# EAGLE design BBBDuino_revA (EAGLE 6.4)
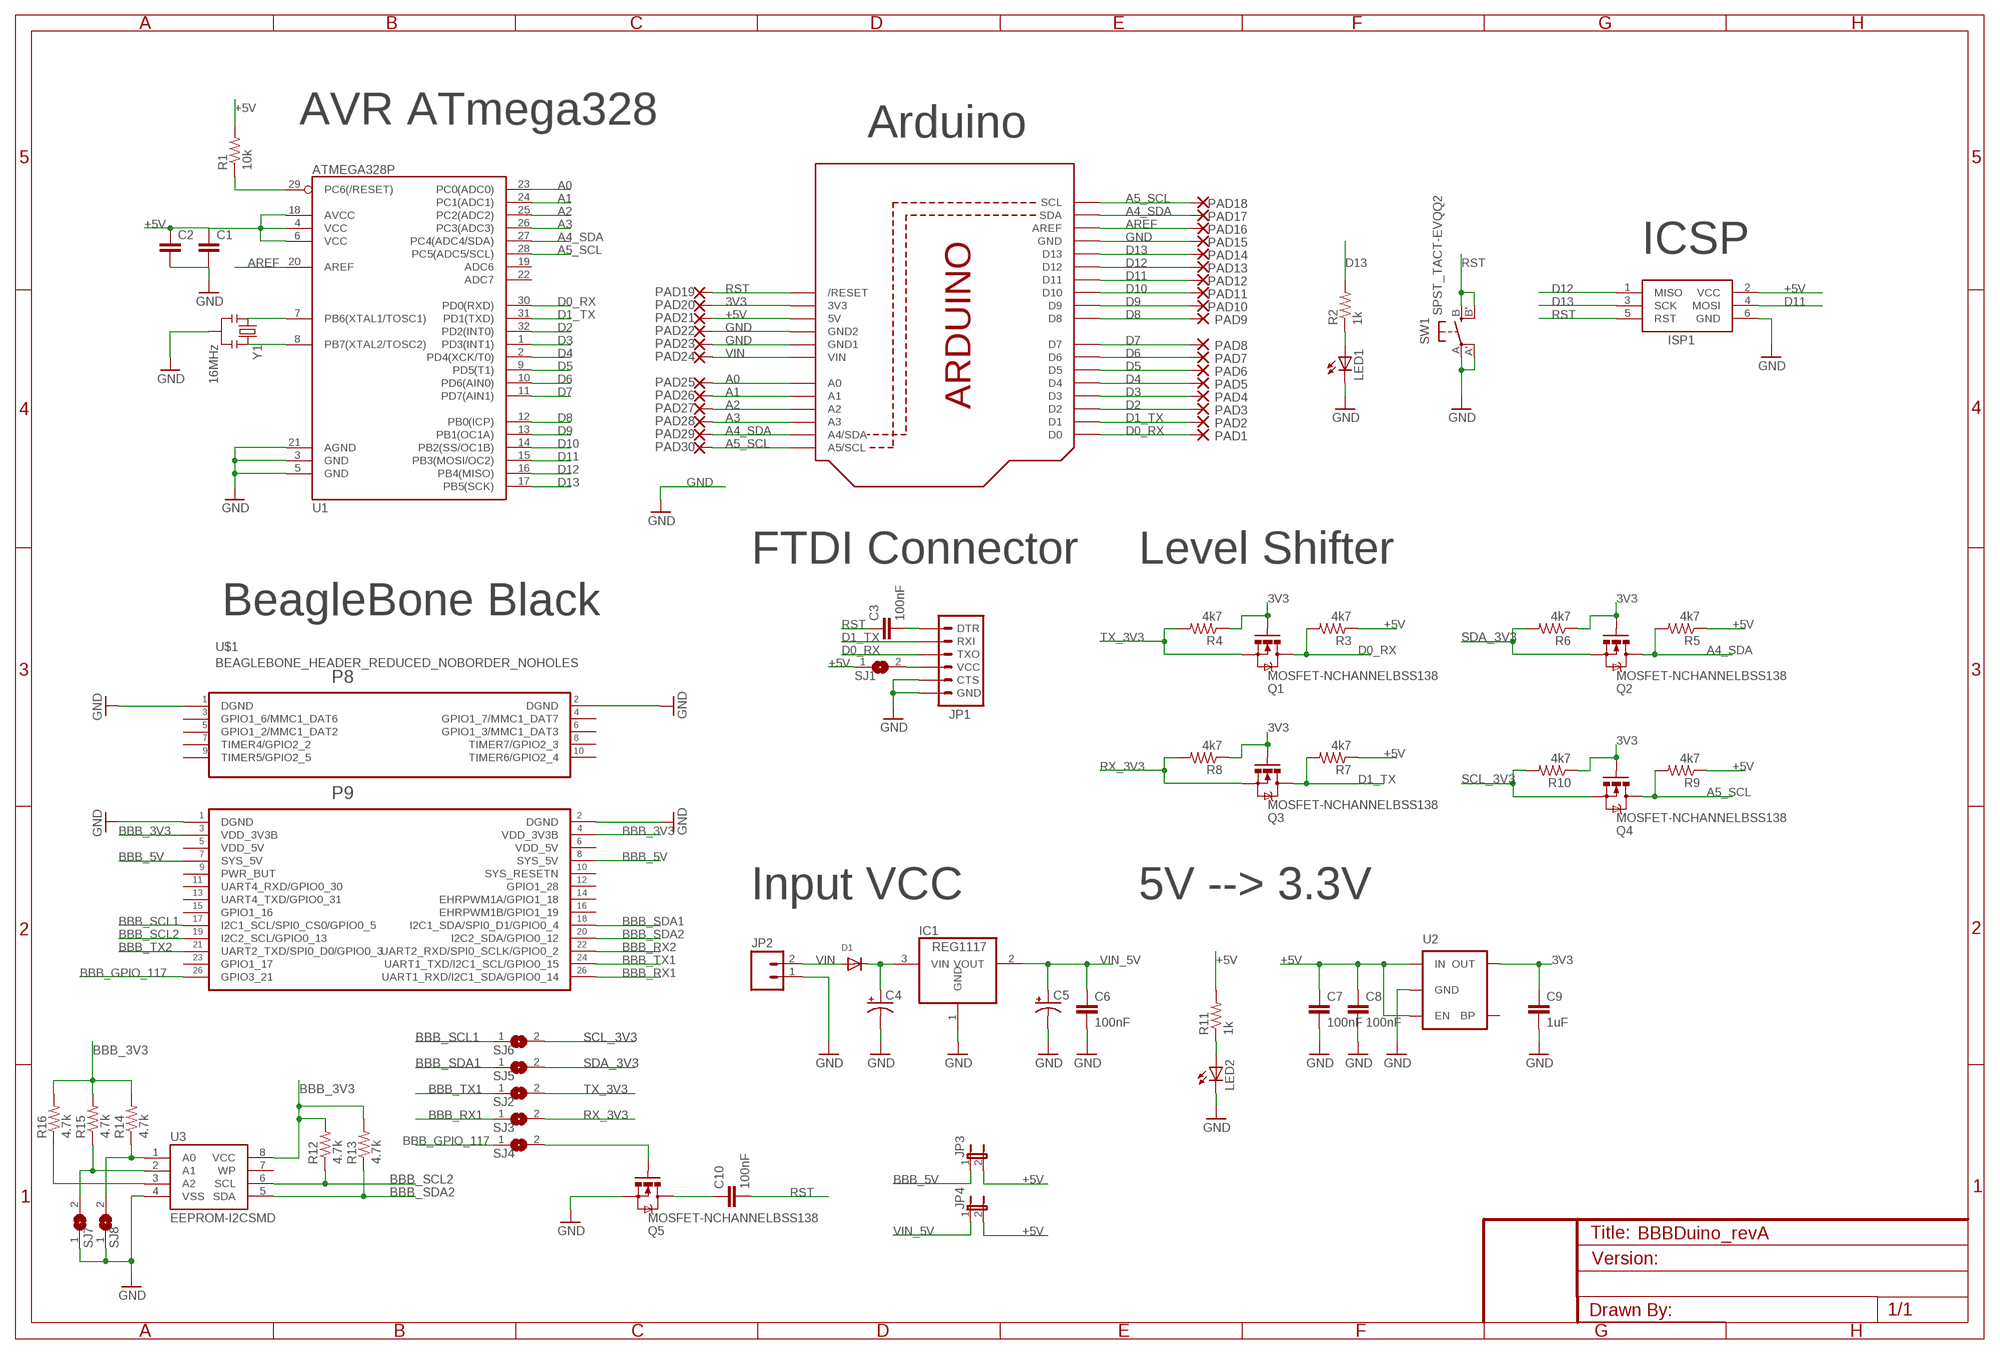
[diagram p0: schematic, sheet 1]

## Parts
C1  CAP0603-CAP  [0603-CAP]
C2  CAP0603-CAP  [0603-CAP]
C3  100nF  CAP0603-CAP  [0603-CAP]
C4  CAP_POLD  [PANASONIC_D]
C5  CAP_POLD  [PANASONIC_D]
C6  100nF  CAP0603-CAP  [0603-CAP]
C7  100nF  CAP0603-CAP  [0603-CAP]
C8  100nF  CAP0603-CAP  [0603-CAP]
C9  1uF  CAP0603-CAP  [0603-CAP]
C10  100nF  CAP0603-CAP  [0603-CAP]
D1  DIODESMA  [SMADIODE]
IC1  REG1117  [SOT223]
ISP1  AVRISP-6  [AVRISP]
JP1  ARDUINO_SERIAL_PROGRAMPTH  [1X06]
JP2  M02PTH  [1X02]
JP3  JUMPER-2PTH  [1X02]
JP4  JUMPER-2PTH  [1X02]
LED1  LEDCHIP-LED0603  [CHIP-LED0603]
LED2  LEDCHIP-LED0603  [CHIP-LED0603]
PAD1  1,6/0,9  [1,6/0,9]
PAD2  1,6/0,9  [1,6/0,9]
PAD3  1,6/0,9  [1,6/0,9]
PAD4  1,6/0,9  [1,6/0,9]
PAD5  1,6/0,9  [1,6/0,9]
PAD6  1,6/0,9  [1,6/0,9]
PAD7  1,6/0,9  [1,6/0,9]
PAD8  1,6/0,9  [1,6/0,9]
PAD9  1,6/0,9  [1,6/0,9]
PAD10  1,6/0,9  [1,6/0,9]
PAD11  1,6/0,9  [1,6/0,9]
PAD12  1,6/0,9  [1,6/0,9]
PAD13  1,6/0,9  [1,6/0,9]
PAD14  1,6/0,9  [1,6/0,9]
PAD15  1,6/0,9  [1,6/0,9]
PAD16  1,6/0,9  [1,6/0,9]
PAD17  1,6/0,9  [1,6/0,9]
PAD18  1,6/0,9  [1,6/0,9]
PAD19  1,6/0,9  [1,6/0,9]
PAD20  1,6/0,9  [1,6/0,9]
PAD21  1,6/0,9  [1,6/0,9]
PAD22  1,6/0,9  [1,6/0,9]
PAD23  1,6/0,9  [1,6/0,9]
PAD24  1,6/0,9  [1,6/0,9]
PAD25  1,6/0,9  [1,6/0,9]
PAD26  1,6/0,9  [1,6/0,9]
PAD27  1,6/0,9  [1,6/0,9]
PAD28  1,6/0,9  [1,6/0,9]
PAD29  1,6/0,9  [1,6/0,9]
PAD30  1,6/0,9  [1,6/0,9]
Q1  MOSFET-NCHANNELBSS138  [SOT23]
Q2  MOSFET-NCHANNELBSS138  [SOT23]
Q3  MOSFET-NCHANNELBSS138  [SOT23]
Q4  MOSFET-NCHANNELBSS138  [SOT23]
Q5  MOSFET-NCHANNELBSS138  [SOT23]
R1  10k  RESISTOR0603-RES  [0603-RES]
R2  1k  RESISTOR0603-RES  [0603-RES]
R3  4k7  RESISTOR0603-RES  [0603-RES]
R4  4k7  RESISTOR0603-RES  [0603-RES]
R5  4k7  RESISTOR0603-RES  [0603-RES]
R6  4k7  RESISTOR0603-RES  [0603-RES]
R7  4k7  RESISTOR0603-RES  [0603-RES]
R8  4k7  RESISTOR0603-RES  [0603-RES]
R9  4k7  RESISTOR0603-RES  [0603-RES]
R10  4k7  RESISTOR0603-RES  [0603-RES]
R11  1k  RESISTOR0603-RES  [0603-RES]
R12  4.7k  RESISTOR0603-RES  [0603-RES]
R13  4.7k  RESISTOR0603-RES  [0603-RES]
R14  4.7k  RESISTOR0603-RES  [0603-RES]
R15  4.7k  RESISTOR0603-RES  [0603-RES]
R16  4.7k  RESISTOR0603-RES  [0603-RES]
SJ1  SJ  [SJ]
SJ2  SJ  [SJ]
SJ3  SJ  [SJ]
SJ4  SJ  [SJ]
SJ5  SJ  [SJ]
SJ6  SJ  [SJ]
SJ7  SJ  [SJ]
SJ8  SJ  [SJ]
SW1  SPST_TACT-EVQQ2  [EVQ-Q2]
U1  ATMEGA328P  ATMEGA328_SMT  [TQFP32-08]
U2  MIC52053.3V  [SOT23-5]
U3  EEPROM-I2CSMD  [SO08]
U$1  BEAGLEBONE_HEADER_REDUCED_NOBORDER_NOHOLES  [BEAGLEBONE_HEADER_REDUCED_NOBORDER_NOHOLES]
U$2  ARDUINO_NOIOREF_NOBORDER_HOLES_NAMES  [ARDUINO_NOIOREF_BORDER_HOLES_NAMES]
Y1  16MHz  RESONATOR16MHZ  [RESONATOR-SMD]

## Nets
3V3: C9.1 PAD20.1(P) Q1.1(G) Q2.1(G) Q3.1(G) Q4.1(G) R4.1 R6.1 R8.1 R10.1 U2.5(OUT) U$2.3V(3V3)
+5V: C1.1 C2.1 C7.1 C8.1 ISP1.2(VCC) JP3.2 JP4.2 PAD21.1(P) R1.2 R3.1 R5.1 R7.1 R9.1 R11.2 SJ1.1 U1.4(VCC) U1.6(VCC) U1.18(AVCC) U2.1(IN) U2.3(EN) U$2.5V
A0: PAD25.1(P) U1.23(PC0(ADC0)) U$2.A0
A1: PAD26.1(P) U1.24(PC1(ADC1)) U$2.A1
A2: PAD27.1(P) U1.25(PC2(ADC2)) U$2.A2
A3: PAD28.1(P) U1.26(PC3(ADC3)) U$2.A3
A4_SDA: PAD17.1(P) PAD29.1(P) Q2.3(D) R5.2 U1.27(PC4(ADC4/SDA)) U$2.A4(A4/SDA) U$2.SDA
A5_SCL: PAD18.1(P) PAD30.1(P) Q4.3(D) R9.2 U1.28(PC5(ADC5/SCL)) U$2.A5(A5/SCL) U$2.SCL
AREF: PAD16.1(P) U1.20(AREF) U$2.AREF
BBB_3V3: R12.2 R13.2 R14.2 R15.2 R16.2 U3.8(VCC) U$1.P9_3(VDD_3V3B) U$1.P9_4(VDD_3V3B)
BBB_5V: JP3.1 U$1.P9_7(SYS_5V) U$1.P9_8(SYS_5V)
BBB_GPIO_117: SJ4.1 U$1.P9_25(GPIO3_21)
BBB_RX1: SJ3.1 U$1.P9_26(UART1_RXD/I2C1_SDA/GPIO0_14)
BBB_RX2: U$1.P9_22(UART2_RXD/SPI0_SCLK/GPIO0_2)
BBB_SCL1: SJ6.1 U$1.P9_17(I2C1_SCL/SPI0_CS0/GPIO0_5)
BBB_SCL2: R12.1 U3.6(SCL) U$1.P9_19(I2C2_SCL/GPIO0_13)
BBB_SDA1: SJ5.1 U$1.P9_18(I2C1_SDA/SPI0_D1/GPIO0_4)
BBB_SDA2: R13.1 U3.5(SDA) U$1.P9_20(I2C2_SDA/GPIO0_12)
BBB_TX1: SJ2.1 U$1.P9_24(UART1_TXD/I2C1_SCL/GPIO0_15)
BBB_TX2: U$1.P9_21(UART2_TXD/SPI0_D0/GPIO0_3)
D0_RX: JP1.3(TXO) PAD1.1(P) Q1.3(D) R3.2 U1.30(PD0(RXD)) U$2.D0
D1_TX: JP1.2(RXI) PAD2.1(P) Q3.3(D) R7.2 U1.31(PD1(TXD)) U$2.D1
D2: PAD3.1(P) U1.32(PD2(INT0)) U$2.D2
D3: PAD4.1(P) U1.1(PD3(INT1)) U$2.D3
D4: PAD5.1(P) U1.2(PD4(XCK/T0)) U$2.D4
D5: PAD6.1(P) U1.9(PD5(T1)) U$2.D5
D6: PAD7.1(P) U1.10(PD6(AIN0)) U$2.D6
D7: PAD8.1(P) U1.11(PD7(AIN1)) U$2.D7
D8: PAD9.1(P) U1.12(PB0(ICP)) U$2.D8
D9: PAD10.1(P) U1.13(PB1(OC1A)) U$2.D9
D10: PAD11.1(P) U1.14(PB2(SS/OC1B)) U$2.D10
D11: ISP1.4(MOSI) PAD12.1(P) U1.15(PB3(MOSI/OC2)) U$2.D11
D12: ISP1.1(MISO) PAD13.1(P) U1.16(PB4(MISO)) U$2.D12
D13: ISP1.3(SCK) PAD14.1(P) R2.2 U1.17(PB5(SCK)) U$2.D13
GND: C1.2 C2.2 C4.- C5.- C6.2 C7.2 C8.2 C9.2 IC1.1(GND) ISP1.6(GND) JP1.5(CTS) JP1.6(GND) JP2.1 LED1.C LED2.C PAD15.1(P) PAD22.1(P) PAD23.1(P) Q5.2(S) SJ7.1 SJ8.1 SW1.A'(P1) SW1.A(P) U1.3(GND) U1.5(GND) U1.21(AGND) U2.2(GND) U3.4(VSS) U$1.P8_1(DGND) U$1.P8_2(DGND) U$1.P9_1(DGND) U$1.P9_2(DGND) U$2.GND U$2.GND1 U$2.GND2 Y1.2
N$1: U1.7(PB6(XTAL1/TOSC1)) Y1.1
N$2: R1.1 U1.29(PC6(/RESET))
N$3: C3.2 JP1.1(DTR)
N$4: U1.8(PB7(XTAL2/TOSC2)) Y1.3
N$5: LED1.A R2.1
N$6: LED2.A R11.1
N$7: C4.+ D1.C IC1.3(VIN)
N$8: JP1.4(VCC) SJ1.2
N$9: C10.1 Q5.3(D)
N$14: Q5.1(G) SJ4.2
N$23: R14.1 SJ8.2 U3.1(A0)
N$24: R15.1 SJ7.2 U3.2(A1)
N$25: R16.1 U3.3(A2)
RST: C3.1 C10.2 ISP1.5(RST) PAD19.1(P) SW1.B'(S1) SW1.B(S) U$2.RESET(/RESET)
RX_3V3: Q3.2(S) R8.2 SJ3.2
SCL_3V3: Q4.2(S) R10.2 SJ6.2
SDA_3V3: Q2.2(S) R6.2 SJ5.2
TX_3V3: Q1.2(S) R4.2 SJ2.2
VIN: D1.A JP2.2 PAD24.1(P) U$2.VIN
VIN_5V: C5.+ C6.1 IC1.2(VOUT) JP4.1
Unconnected: U1.19(ADC6) U1.22(ADC7) U2.4(BP) U3.7(WP) U$1.P8_3(GPIO1_6/MMC1_DAT6) U$1.P8_4(GPIO1_7/MMC1_DAT7) U$1.P8_5(GPIO1_2/MMC1_DAT2) U$1.P8_6(GPIO1_3/MMC1_DAT3) U$1.P8_7(TIMER4/GPIO2_2) U$1.P8_8(TIMER7/GPIO2_3) U$1.P8_9(TIMER5/GPIO2_5) U$1.P8_10(TIMER6/GPIO2_4) U$1.P9_9(PWR_BUT) U$1.P9_10(SYS_RESETN) U$1.P9_11(UART4_RXD/GPIO0_30) U$1.P9_12(GPIO1_28) U$1.P9_13(UART4_TXD/GPIO0_31) U$1.P9_14(EHRPWM1A/GPIO1_18) U$1.P9_15(GPIO1_16) U$1.P9_16(EHRPWM1B/GPIO1_19) U$1.P9_23(GPIO1_17)

## Notes on the sheet
- AVR ATmega328 | Arduino
- ICSP
- FTDI Connector | Level Shifter
- BeagleBone Black
- Input VCC | 5V --> 3.3V

## Power pins joined to a net without a drawn wire
VDD_5V: U$1.P9_5(VDD_5V) U$1.P9_6(VDD_5V)

## Library data of the parts
C1-C3 C6-C10 = SparkFun-Capacitors:CAP: Capacitor Standard 0603 ceramic capacitor, and 0.1" leaded capacitor.
C4 C5 = SparkFun-Capacitors:CAP_POL: Capacitor Polarized These are standard SMD and PTH capacitors. Normally 10uF, 47uF, and 100uF in electrolytic and tantalum varieties. Always verify the external diameter of the through hole cap, it varies with capacity, voltage, and manufacturer. The EIA devices should be standard.
D1 = adafruit:DIODE: Diode SMADIODE - SMA Surface Mount Package 20V 1A Schottky Diode Digikey: 641-1014-6-ND DO-1N4148 - Through Hole Small Current Diode SOD-123 20V 1 A (.5mV Vf) Schottky Diode - Digikey: MBRX120TPMSCT-ND SOD-323 10V 570mA (.38mV Vf, 3ns) Schottky Diode - Digikey: ZLLS410CT-ND SOD-523 30V 30mA Schottky Diode (RB751S-40TE61) - Digikey: RB751S-40TE61CT-ND SOT23-R/W - SOT23 Package (R = Solder Paste/Reflow Ovens, W = Hand-Soldering) BAT54Film 40V 300mA - Digikey: 497-7162-1-ND
IC1 = burr-brown:REG1117: 800mA and 1A Low Dropout (LDO) Positive Regulator 1.8V, 2.5V, 2.85V, 3.3V, 5V, and Adj; MPN: REG1117; OC_FARNELL: 1097566; OC_NEWARK: 14P6981
ISP1 = adafruit:AVRISP: AVR ISP HEADER Standard 6 pin header for AVR programming
JP1 = SparkFun-Connectors:ARDUINO_SERIAL_PROGRAM: FTDI connector footprints
JP2 = SparkFun-Connectors:M02: Header 2 Standard 2-pin 0.1" header. Use with straight break away headers (SKU : PRT-00116), right angle break away headers (PRT-00553), swiss pins (PRT-00743), machine pins (PRT-00117), and female headers (PRT-00115). Molex polarized connector foot print use with SKU : PRT-08233 with associated crimp pins and housings.
JP3 JP4 = SparkFun-Passives:JUMPER-2: Jumper Basic 0.1" spaced jumper. Use with breakaway headers.
LED1 LED2 = adafruit:LED: LED OSRAM: - CHIPLED LG R971, LG N971, LY N971, LG Q971, LY Q971, LO R971, LY R971 LH N974, LH R974 LS Q976, LO Q976, LY Q976 LO Q996 - Hyper CHIPLED LW Q18S LB Q993, LB Q99A, LB R99A - SideLED LS A670, LO A670, LY A670, LG A670, LP A670 LB A673, LV A673, LT A673, LW A673 LH A674 LY A675 LS A676, LA A676, LO A676, LY A676, LW A676 LS A679, LY A679, LG A679 - Hyper Micro SIDELED® LS Y876, LA Y876, LO Y876, LY Y876 LT Y87S - SmartLED LW L88C, LW L88S LB L89C, LB L89S, LG L890 LS L89K, LO L89K, LY L89K LS L896, LA L896, LO L896, LY L896 - TOPLED LS T670, LO T670, LY T670, LG T670, LP T670 LSG T670, LSP T670, LSY T670, LOP T670, LYG T670 LG T671, LOG T671, LSG T671 LB T673, LV T673, LT T673, LW T673 LH T674 LS T676, LA T676, LO T676, LY T676, LB T676, LH T676, LSB T676, LW T676 LB T67C, LV T67C, LT T67C, LS T67K, LO T67K, LY T67K, LW E67C LS E67B, LA E67B, LO E67B, LY E67B, LB E67C, LV E67C, LT E67C LW T67C LS T679, LY T679, LG T679 LS T770, LO T770, LY T770, LG T770, LP T770 LB T773, LV T773, LT T773, LW T773 LH T774 LS E675, LA E675, LY E675, LS T675 LS T776, LA T776, LO T776, LY T776, LB T776 LHGB T686 LT T68C, LB T68C - Hyper Mini TOPLED® LB M676 - Mini TOPLED Santana® LG M470 LS M47K, LO M47K, LY M47K Source: http://www.osram.convergy.de/
PAD1-PAD30 = wirepad:1,6/0,9: THROUGH-HOLE PAD
Q1-Q5 = SparkFun-DiscreteSemi:MOSFET-NCHANNEL: Common NMOSFET Parts MFG P/N Store ID Prod ID FDD8780 TRANS-09984 SI7820DN TRANS-11055 FDS6630A IC-08089 2N7002PW TRANS-11151 FQP30N06L COM-10213 TRANS-10060 BSS123LT1G TRANS-08345 BSS138 TRANS-00830 BS170 2N7000; PROD_ID: TRANS-00830
R1-R16 = SparkFun-Passives:RESISTOR: Resistor Basic schematic elements and footprints for 0603, 1206, and PTH resistors.
SJ1-SJ8 = jumper:SJ: SMD solder JUMPER
SW1 = adafruit:SPST_TACT: SMT 6mm switch, EVQQ2 series http://www.ladyada.net/library/eagle
U1 = SparkFun-DigitalIC:ATMEGA328_SMT: 32-Pin Atmega328 part Commonly used on Arduino compatible boards Available in QFP and QFN packages TQFP is IC-09069 QFN is non-stock; PROD_ID: IC-09069
U2 = SparkFun-PowerIC:MIC5205: MIC5205 150mA vreg 3.3V - VREG-00822 5V - VREG-00823; PROD_ID: VREG-00822
U3 = SparkFun-DigitalIC:EEPROM-I2C: I2C EEPROM chips, 24LC256 (and others)
U$1 = adafruit-beaglebone:BEAGLEBONE_HEADER_REDUCED
U$2 = adafruit-beaglebone:ARDUINO_NOIOREF
Y1 = SparkFun-FreqCtrl:RESONATOR: Resonator Small SMD resonator. Used, eg, on the Arduino Pro/ Pro Mini boards. 8MHz- XTAL-08895 16MHz- XTAL-08900; PROD_ID: XTAL-08900

## Board
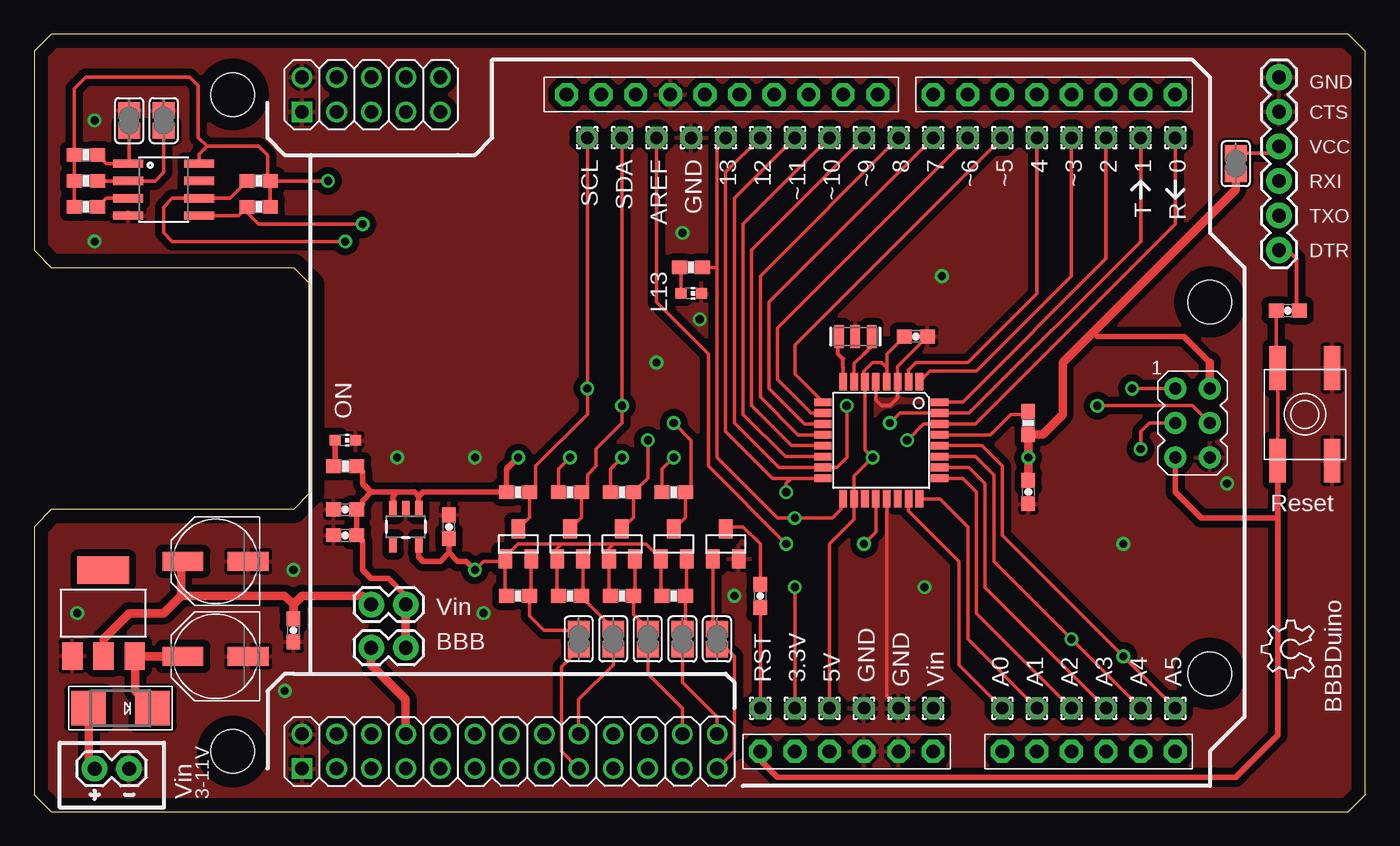
[diagram p1: board, top side]
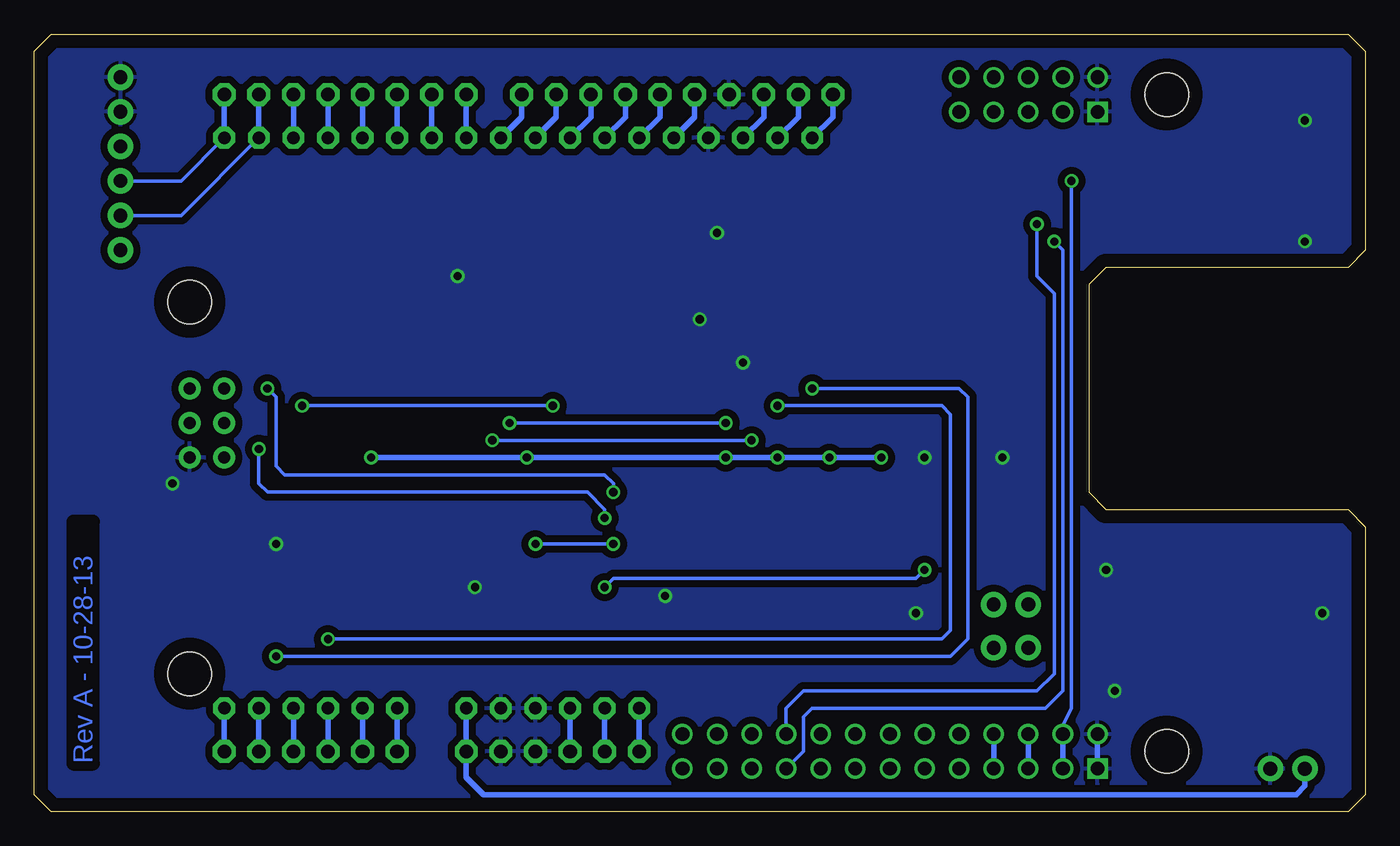
[diagram p2: board, bottom side, seen from below]

Size 97.79 x 57.15 mm. Coordinates in mm from the lower left corner, seen from the top.
Outline: 0,55.88 0,41.27 1.27,40.01 19.05,40.01 20.32,38.73 20.32,23.5 19.05,22.23 1.27,22.23 0,20.95 0,1.27 1.27,0 96.52,0 97.79,1.27 97.79,55.88 96.52,57.15 1.27,57.15 0,55.88
Copper layers (1*16): Top 0.035mm / dielectric 1.5mm / Bottom 0.035mm
Design rules "default": minimum track width 10mil, minimum drill 24mil, track to track 8mil, track to pad 8mil, pad to pad 8mil, via to via 8mil, smd to smd 8mil, copper to edge 40mil, drill to drill 8mil, minimum pad ring 10mil, minimum via ring 8mil, stop-mask expansion 4mil, vias tented up to drill 0mil, thermal gap 10mil
Holes 3.2 mm at 86.36,10.16 86.36,37.47 14.61,52.7 14.61,4.45
tRestrict: area 58.4,31.1 to 64.8,34.3

### Footprints (pad centres in the part's own frame; a part is rotated, then mirrored left to right if it is on the bottom)
0603-CAP = smd 1.1 x 1: 1 -0.85,0; 2 0.85,0
PANASONIC_D = smd 3 x 1.4: + 2.4,0; - -2.4,0
SMADIODE = smd 2.54 x 2.54: A 2.349,0; C -2.349,0
SOT223 = smd 1.499 x 2.007: 1 -2.261,-3.15; 2 0.025,-3.15; 3 2.311,-3.15 | smd 3.81 x 2.007: 4 0,3.15
AVRISP = drill 0.9 pad 1.626: 1 -1.27,2.54; 2 1.27,2.54; 3 -1.27,0; 4 1.27,0; 5 -1.27,-2.54; 6 1.27,-2.54
1X06 = drill 1.016 pad 1.88: 1 0,0; 2 2.54,0; 3 5.08,0; 4 7.62,0; 5 10.16,0; 6 12.7,0
1X02 = drill 1.016 pad 1.88: 1 0,0; 2 2.54,0
CHIP-LED0603 = smd 0.8 x 0.8: A 0,-0.75; C 0,0.75
1,6/0,9 = drill 0.914 pad 1.6 octagon: 1 0,0
SOT23 = smd 1 x 1.4: 1 -0.95,-1.1; 2 0.95,-1.1; 3 0,1.1
0603-RES = smd 1.1 x 1: 1 -0.85,0; 2 0.85,0
SJ = smd 1.168 x 1.6: 1 -0.762,0; 2 0.762,0
EVQ-Q2 = smd 3.2 x 1.2: A -3.4,-2; A' 3.4,-2; B -3.4,2; B' 3.4,2
TQFP32-08 = smd 1.27 x 0.559: 1 -4.293,2.8; 2 -4.293,2; 3 -4.293,1.2; 4 -4.293,0.4; 5 -4.293,-0.4; 6 -4.293,-1.2; 7 -4.293,-2; 8 -4.293,-2.8; 17 4.293,-2.8; 18 4.293,-2; 19 4.293,-1.2; 20 4.293,-0.4; 21 4.293,0.4; 22 4.293,1.2; 23 4.293,2; 24 4.293,2.8 | smd 0.559 x 1.27: 9 -2.8,-4.293; 10 -2,-4.293; 11 -1.2,-4.293; 12 -0.4,-4.293; 13 0.4,-4.293; 14 1.2,-4.293; 15 2,-4.293; 16 2.8,-4.293; 25 2.8,4.293; 26 2,4.293; 27 1.2,4.293; 28 0.4,4.293; 29 -0.4,4.293; 30 -1.2,4.293; 31 -2,4.293; 32 -2.8,4.293
SOT23-5 = smd 0.55 x 1.2: 1 -0.95,-1.3; 2 0,-1.3; 3 0.95,-1.3; 4 0.95,1.3; 5 -0.95,1.3
SO08 = smd 0.61 x 2.21: 1 -1.905,-2.616; 2 -0.635,-2.616; 3 0.635,-2.616; 4 1.905,-2.616; 5 1.905,2.616; 6 0.635,2.616; 7 -0.635,2.616; 8 -1.905,2.616
BEAGLEBONE_HEADER_REDUCED_NOBORDER_NOHOLES = drill 1 square: P8_1 19.685,50.165; P9_1 19.685,1.905 | drill 1: P8_2 19.685,52.705; P8_3 22.225,50.165; P8_4 22.225,52.705; P8_5 24.765,50.165; P8_6 24.765,52.705; P8_7 27.305,50.165; P8_8 27.305,52.705; P8_9 29.845,50.165; P8_10 29.845,52.705; P9_2 19.685,4.445; P9_3 22.225,1.905; P9_4 22.225,4.445; P9_5 24.765,1.905; P9_6 24.765,4.445; P9_7 27.305,1.905; P9_8 27.305,4.445; P9_9 29.845,1.905; P9_10 29.845,4.445; P9_11 32.385,1.905; P9_12 32.385,4.445; P9_13 34.925,1.905; P9_14 34.925,4.445; P9_15 37.465,1.905; P9_16 37.465,4.445; P9_17 40.005,1.905; P9_18 40.005,4.445; P9_19 42.545,1.905; P9_20 42.545,4.445; P9_21 45.085,1.905; P9_22 45.085,4.445; P9_23 47.625,1.905; P9_24 47.625,4.445; P9_25 50.165,1.905; P9_26 50.165,4.445
ARDUINO_NOIOREF_BORDER_HOLES_NAMES = drill 1 pad 1.676 octagon: 3V 35.56,2.54; 5V 38.1,2.54; A0 50.8,2.54; A1 53.34,2.54; A2 55.88,2.54; A3 58.42,2.54; A4 60.96,2.54; A5 63.5,2.54; AREF 23.876,50.8; D0 63.5,50.8; D1 60.96,50.8; D2 58.42,50.8; D3 55.88,50.8; D4 53.34,50.8; D5 50.8,50.8; D6 48.26,50.8; D7 45.72,50.8; D8 41.656,50.8; D9 39.116,50.8; D10 36.576,50.8; D11 34.036,50.8; D12 31.496,50.8; D13 28.956,50.8; GND 26.416,50.8; GND1 43.18,2.54; GND2 40.64,2.54; RESET 33.02,2.54; SCL 18.796,50.8; SDA 21.336,50.8; VIN 45.72,2.54
RESONATOR-SMD = smd 0.7 x 1.7: 1 -1.2,0; 2 0,0; 3 1.2,0

### Placement (x,y rotation side)
C1  64.77,34.92 0 top
C2  73.03,23.5 270 top
C3  92.08,36.83 0 top
C4  13.34,11.43 180 top
C5  13.34,18.41 180 top
C6  19.05,13.34 270 top
C7  22.86,20.32 180 top
C8  22.86,22.23 180 top
C9  30.48,20.95 90 top
C10  53.34,15.88 270 top
D1  6.35,7.62 180 top
IC1  5.08,14.61 0 top
ISP1  85.09,28.57 0 top
JP1  91.44,41.27 90 top
JP2  6.99,3.17 180 top
JP3  24.77,12.06 0 top
JP4  24.77,15.24 0 top
LED1  48.26,38.1 270 top
LED2  22.86,27.3 270 top
LOGO1  OSHW_LOGO_6MILX0150-NT  [OSHW_6X150_NOTEXT]  93.98,9.84 90 top
PAD1  83.82,49.53 0 top
PAD2  81.28,49.53 0 top
PAD3  78.74,49.53 0 top
PAD4  76.2,49.53 0 top
PAD5  73.66,49.53 0 top
PAD6  71.12,49.53 0 top
PAD7  68.58,49.53 0 top
PAD8  66.04,49.53 0 top
PAD9  63.5,49.53 0 top
PAD10  60.96,49.53 0 top
PAD11  58.42,49.53 0 top
PAD12  55.88,49.53 0 top
PAD13  53.34,49.53 0 top
PAD14  50.8,49.53 0 top
PAD15  48.26,49.53 0 top
PAD16  45.72,49.53 0 top
PAD17  43.18,49.53 0 top
PAD18  40.64,49.53 0 top
PAD19  53.34,7.62 0 top
PAD20  55.88,7.62 0 top
PAD21  58.42,7.62 0 top
PAD22  60.96,7.62 0 top
PAD23  63.5,7.62 0 top
PAD24  66.04,7.62 0 top
PAD25  71.12,7.62 0 top
PAD26  73.66,7.62 0 top
PAD27  76.2,7.62 0 top
PAD28  78.74,7.62 0 top
PAD29  81.28,7.62 0 top
PAD30  83.82,7.62 0 top
Q1  43.18,19.68 0 top
Q2  39.37,19.68 0 top
Q3  46.99,19.68 0 top
Q4  35.56,19.68 0 top
Q5  50.8,19.68 0 top
R1  73.03,28.57 270 top
R2  48.26,40.01 0 top
R3  43.18,23.5 0 top
R4  43.18,15.88 0 top
R5  39.37,23.5 0 top
R6  39.37,15.88 0 top
R7  46.99,23.5 0 top
R8  46.99,15.88 0 top
R9  35.56,23.5 0 top
R10  35.56,15.88 0 top
R11  22.86,25.4 0 top
R12  16.51,46.35 0 top
R13  16.51,44.45 0 top
R14  3.81,48.26 180 top
R15  3.81,46.35 180 top
R16  3.81,44.45 180 top
SJ1  88.27,47.62 90 top
SJ2  45.09,12.7 90 top
SJ3  47.62,12.7 90 top
SJ4  50.16,12.7 90 top
SJ5  42.55,12.7 90 top
SJ6  40.01,12.7 90 top
SJ7  9.53,50.8 270 top
SJ8  6.99,50.8 270 top
SW1  93.34,29.21 90 top
U1  62.23,27.3 270 top
U2  27.3,20.95 180 top
U3  9.53,45.72 270 top
U$1  0,1.27 0 top
U$2  20.32,1.91 0 top
Y1  60.33,34.92 180 top

### Tracks (layer width: path | path; a pad name or v marks a point on that pad's centre or on a via)
3V3  (via drill 0.6)
  Top 0.254: R6.1 38.42,15.97 Q2.1 38.42,19.37 38.73,19.68 | Q4.1 34.61,15.97 R10.1 | R4.1 42.23,15.97 Q1.1 42.23,19.37 42.55,19.68 | R8.1 46.04,15.97 Q3.1 44.94,19.68 42.55,19.68 | Q4.1 34.61,18.73 35.56,19.68 38.73,19.68 | 38.73,19.68 42.55,19.68 | PAD20.1 v55.88,16.51 | v32.38,17.78 33.02,18.41 34.44,18.41 Q4.1
  Top 0.406: U2.5 28.25,18.73 28.57,18.41 29.84,18.41 30.48,19.05 | C9.1 30.48,19.05 | 30.48,19.05 31.11,18.41 31.75,18.41 v32.38,17.78
  Bottom 0.254: v55.88,16.51 55.24,17.14 33.02,17.14 v32.38,17.78
  Bottom 0.406: U$2.3V PAD20.1
+5V  (via drill 0.6)
  Top 0.254: R3.1 42.33,25.18 v43.18,26.04 | R5.1 38.52,25.18 v39.37,26.04 | R7.1 46.14,25.18 v46.99,26.04 | C1.1 62.63,33.63 U1.4 62.63,32.62 62.23,33.02 61.59,33.02 60.96,32.38 60.96,31.67 U1.6 61.03,26.6 v61.59,26.04 60.23,24.67 U1.18 60.23,21.5 58.42,19.68 PAD21.1
  Top 0.406: v35.56,26.04 34.71,25.18 R9.1 28.57,23.5 28.25,23.18 | C8.1 C7.1 24.13,19.9 24.13,17.78 24.77,17.14 26.04,17.14 27.3,15.88 JP4.2 | 28.25,23.18 27.94,23.5 26.67,23.5 | 26.67,23.5 24.77,23.5 | 24.77,23.5 24.13,22.86 24.13,22.64 C8.1 | 23.5,22.44 C8.1 | 24.77,23.5 24.13,24.13 24.13,24.98 R11.2 | 26.67,23.5 26.36,23.18 U2.3 | 86.36,33.02 84.45,34.92 78.11,34.92 77.79,35.24 | U2.1 28.25,23.18
  Top 0.61: JP4.2 JP3.2 | C2.1 v73.03,26.04 R1.2 74.08,27.73 75.56,29.21 75.56,33.02 77.79,35.24 88.27,45.72 SJ1.1 | ISP1.2 86.36,33.02
  Bottom 0.406: U$2.5V PAD21.1 | v35.56,26.04 v39.37,26.04 v43.18,26.04 v46.99,26.04 v61.59,26.04 v73.03,26.04
A0
  Top 0.254: U1.23 64.23,22.13 67.94,18.41 67.94,10.79 68.26,10.48 PAD25.1
  Bottom 0.406: U$2.A0 PAD25.1
A1
  Top 0.254: U1.24 66.52,23.01 68.58,20.95 68.58,12.7 PAD26.1
  Bottom 0.406: U$2.A1 PAD26.1
A2
  Top 0.254: U1.25 68.2,24.5 69.22,23.5 69.22,14.61 PAD27.1
  Bottom 0.406: U$2.A2 PAD27.1
A3
  Top 0.254: U1.26 68.67,25.3 69.85,24.13 69.85,16.51 PAD28.1
  Bottom 0.406: PAD28.1 U$2.A3
A4_SDA  (via drill 0.6)
  Top 0.254: Q2.3 40.22,21.64 R5.2 40.64,23.91 40.64,24.77 41.27,25.4 41.27,26.67 43.18,28.57 v43.18,29.84 PAD17.1 | U1.27 69.14,26.11 70.48,24.77 70.48,18.41 v76.2,12.7 PAD29.1
  Bottom 0.254: v43.18,29.84 31.11,29.84 30.48,29.21 30.48,13.34 31.11,12.7 v76.2,12.7
  Bottom 0.406: U$2.SDA 41.66,51.05 PAD17.1 | U$2.A4 PAD29.1
A5_SCL  (via drill 0.6)
  Top 0.254: Q4.3 36.41,21.64 R9.2 36.83,23.91 36.83,25.4 40.64,29.21 v40.64,31.11 PAD18.1 | U1.28 69.61,26.91 71.12,25.4 71.12,20.32 v80.01,11.43 PAD30.1
  Bottom 0.254: v40.64,31.11 29.84,31.11 29.21,30.48 29.21,12.7 30.48,11.43 v80.01,11.43
  Bottom 0.406: U$2.SCL 39.12,51.05 PAD18.1 | U$2.A5 PAD30.1
AREF  (via drill 0.6)
  Top 0.254: PAD16.1 45.72,37.47 49.53,33.66 49.53,25.4 v55.24,19.68 | U1.20 61.83,20.55 v60.96,19.68
  Bottom 0.254: v60.96,19.68 v55.24,19.68
  Bottom 0.406: U$2.AREF 44.2,51.05 PAD16.1
BBB_3V3  (via drill 0.6)
  Top 0.254: R16.2 R15.2 R14.2 2.96,53.12 3.81,53.98 11.43,53.98 12.06,53.34 12.06,49.53 12.7,48.9 | 12.7,47.62 U3.8 12.14,48.34 12.7,48.9 | R12.2 17.14,45.94 17.14,48.26 16.51,48.9 12.7,48.9 | R12.2 R13.2 | R12.2 v21.59,46.35
  Bottom 0.254: U$1.P9_4 22.23,6.35 21.59,7.62 v21.59,46.35
  Bottom 0.406: U$1.P9_4 U$1.P9_3
BBB_5V
  Top 0.61: JP3.1 24.77,10.79 27.3,8.26 U$1.P9_8
  Bottom 0.406: U$1.P9_8 U$1.P9_7
BBB_GPIO_117
  Top 0.254: U$1.P9_25 51.44,4.45 51.44,11.43 50.8,12.06 50.29,12.06 SJ4.1
BBB_RX1
  Top 0.254: U$1.P9_26 50.16,6.99 47.62,9.53 SJ3.1
BBB_SCL1
  Top 0.254: U$1.P9_17 38.73,4.45 38.73,10.67 SJ6.1
BBB_SCL2  (via drill 0.6)
  Top 0.254: R12.1 14.39,45.09 U3.6 10.16,45.09 9.53,44.45 9.53,42.55 10.16,41.91 v22.86,41.91
  Bottom 0.254: U$1.P9_19 41.27,4.45 41.27,6.99 40.64,7.62 23.5,7.62 22.23,8.89 22.23,41.27 v22.86,41.91
BBB_SDA1
  Top 0.254: SJ5.1 42.55,10.79 40.01,8.26 U$1.P9_18
BBB_SDA2  (via drill 0.6)
  Top 0.254: U3.5 15.03,43.81 R13.1 15.66,44.03 16.51,43.18 v24.13,43.18
  Bottom 0.254: U$1.P9_20 42.55,7.62 41.27,8.89 24.13,8.89 22.86,10.16 22.86,38.1 24.13,39.37 v24.13,43.18
BBB_TX1
  Top 0.254: U$1.P9_24 47.62,7.62 45.09,10.16 SJ2.1
D0_RX  (via drill 0.6)
  Top 0.254: PAD1.1 83.82,43.18 69.14,28.5 U1.30 65.33,28.5 v64.14,27.3 | Q1.3 44.03,21.64 R3.2 45.09,24.55 v45.09,27.3
  Bottom 0.254: v64.14,27.3 v45.09,27.3 | JP1.3 87,46.35 PAD1.1
  Bottom 0.406: U$2.D0 PAD1.1
D1_TX  (via drill 0.6)
  Top 0.254: PAD2.1 81.28,41.91 68.67,29.3 U1.31 63.59,29.3 v62.87,28.57 | Q3.3 47.84,21.64 R7.2 48.26,23.91 48.26,27.3 v46.99,28.57
  Bottom 0.254: v62.87,28.57 v46.99,28.57 | JP1.2 87,43.81 PAD2.1
  Bottom 0.406: U$2.D1 PAD2.1
D2
  Top 0.254: U1.32 68.2,30.11 78.74,40.64 PAD3.1
  Bottom 0.406: U$2.D2 PAD3.1
D3
  Top 0.254: 65.03,32.01 U1.1 65.82,32.38 69.22,32.38 76.2,39.37 PAD4.1
  Bottom 0.406: PAD4.1 U$2.D3
D4
  Top 0.254: U1.2 64.23,32.48 64.77,33.02 68.58,33.02 73.66,38.1 PAD5.1
  Bottom 0.406: U$2.D4 PAD5.1
D5
  Top 0.254: PAD6.1 55.88,34.29 55.88,32.16 U1.9
  Bottom 0.406: U$2.D5 PAD6.1
D6
  Top 0.254: U1.10 57.05,29.3 54.61,31.75 54.61,35.56 PAD7.1
  Bottom 0.406: PAD7.1 U$2.D6
D7
  Top 0.254: U1.11 56.59,28.5 53.98,31.11 53.98,37.47 PAD8.1
  Bottom 0.406: U$2.D7 PAD8.1
D8
  Top 0.254: U1.12 56.12,27.7 53.34,30.48 53.34,39.37 PAD9.1
  Bottom 0.406: U$2.D8 61.98,51.05 PAD9.1
D9
  Top 0.254: U1.13 55.65,26.91 52.7,29.84 52.7,41.27 PAD10.1
  Bottom 0.406: U$2.D9 59.44,51.05 PAD10.1
D10
  Top 0.254: PAD11.1 52.07,43.18 52.07,29.21 55.17,26.11 U1.14
  Bottom 0.406: U$2.D10 56.9,51.05 PAD11.1
D11  (via drill 0.6)
  Top 0.254: PAD12.1 51.44,45.09 51.44,28.57 54.7,25.3 U1.15 58.96,25.3 59.69,26.04 v59.69,29.84 | v78.11,29.84 85.09,29.84 ISP1.4
  Bottom 0.254: v59.69,29.84 v78.11,29.84
  Bottom 0.406: U$2.D11 54.36,51.05 PAD12.1
D12  (via drill 0.6)
  Top 0.254: PAD13.1 50.8,46.99 50.8,27.94 54.23,24.5 U1.16 55.62,24.5 55.24,24.13 v55.24,23.5 | v80.64,31.11 ISP1.1
  Bottom 0.254: v55.24,23.5 55.24,24.13 55.88,24.77 79.38,24.77 80.01,25.4 80.01,30.48 v80.64,31.11
  Bottom 0.406: U$2.D12 51.82,51.05 PAD13.1
D13  (via drill 0.6)
  Top 0.254: 50.16,40.01 50.16,26.04 54.61,21.59 v55.88,21.59 58.64,21.59 59.28,22.23 U1.17 | 50.16,40.01 50.16,48.9 PAD14.1 | R2.2 50.16,40.01 | ISP1.3 81.92,28.57 81.28,27.94 v81.28,26.67
  Bottom 0.254: v81.28,26.67 81.28,24.13 80.64,23.5 57.15,23.5 55.88,22.23 v55.88,21.59
  Bottom 0.406: U$2.D13 49.28,51.05 PAD14.1
GND  (via drill 0.6)
  Top 0.254: 65.62,34.51 C1.2 63.43,32.73 U1.3 63.43,30.41 62.87,29.84 62.23,29.84 61.83,30.25 U1.5 | U1.21 62.63,8.49 PAD23.1
  Bottom 0.406: U$1.P9_1 U$1.P9_2
  other vias: 18.41,8.89 19.05,17.78 4.45,50.8 4.45,41.91 47.62,42.55 66.67,39.37 33.02,14.61 65.41,16.51 87.63,24.13 45.72,33.02 51.44,15.88 80.01,19.68 48.9,36.2 26.67,26.04 32.38,26.04 3.17,14.61
  pour Bottom (isolate 0.508): 0,57.15 0,0 97.79,0 97.79,57.15
  pour Top (isolate 0.508): -1.27,58.42 -1.27,-1.27 99.06,-1.27 99.06,58.42
N$1
  Top 0.254: U1.7 60.23,32.92 60.96,33.66
  Top 0.305: 60.96,33.66 61.59,34.29 61.59,34.85 Y1.1
N$2
  Top 0.254: U1.29 70.25,27.7 71.75,29.21 72.81,29.21 R1.1
N$3
  Top 0.305: JP1.1 92.08,41.27 92.71,40.64 92.71,37.05 C3.2
N$4
  Top 0.254: U1.8 59.43,32.65
  Top 0.305: 59.43,32.65 59.43,33.28 59.05,33.66 59.05,34.85 Y1.3
N$5
  Top 0.254: LED1.A 47.51,39.91 R2.1
N$6
  Top 0.406: LED2.A 22.11,25.5 R11.1
N$7
  Top 0.61: 7.43,11.42 IC1.3 | 7.43,11.42 10.92,11.42 C4.+ | 7.43,11.42 7.43,8.89 D1.C
N$8
  Top 0.254: SJ1.2 90.93,48.39 JP1.4
N$9
  Top 0.254: C10.1 53.34,19.68 52.07,20.95 50.97,20.95 Q5.3 51.27,20.32
N$14
  Top 0.254: Q5.1 49.85,13.78 SJ4.2
N$23
  Top 0.254: R14.1 5.29,47.62 U3.1 6.99,47.7 SJ8.2
N$24
  Top 0.254: R15.1 U3.2 8.89,46.35 9.53,46.99 SJ7.2
N$25
  Top 0.254: U3.3 5.29,45.09 R16.1
RST
  Top 0.254: C10.2 PAD19.1 | SW1.B SW1.B' 91.44,32.52 91.44,32.38 91.22,32.6 C3.1
  Top 0.406: SW1.B 91.34,21.59 | 91.34,21.59 91.34,5.62 88.27,2.54 54.61,2.54 53.34,3.81 U$2.RESET | ISP1.5 83.82,23.5 85.72,21.59 91.34,21.59
  Bottom 0.406: U$2.RESET PAD19.1
RX_3V3
  Top 0.254: Q3.2 47.94,15.97 R8.2 47.84,13.68 SJ3.2
SCL_3V3
  Top 0.254: SJ6.2 39.88,13.34 37.47,13.34 36.41,14.39 R10.2 36.51,15.97 Q4.2
SDA_3V3
  Top 0.254: SJ5.2 40.22,15.79 R6.2 40.32,15.97 Q2.2
TX_3V3
  Top 0.254: Q1.2 44.13,15.97 R4.2 44.03,14.52 SJ2.2
VDD_5V
  Bottom 0.406: U$1.P9_6 U$1.P9_5
VIN
  Top 0.61: D1.A 4,3.62 JP2.2
  Bottom 0.406: PAD24.1 U$2.VIN 66.04,2.54 64.77,1.27 5.08,1.27 4.45,1.91 JP2.2
VIN_5V
  Top 0.61: IC1.2 5.11,12.72 6.99,14.61 9.53,14.61 10.79,15.88 | 10.79,15.88 10.79,18.27 C5.+ | C6.1 19.05,15.24 | 19.05,15.24 18.41,15.88 10.79,15.88 | 19.05,15.24 19.68,15.88 24.13,15.88 JP4.1

### Text on the board
Bottom: Rev A - 10-28-13
tPlace: GND | CTS | VCC | SCL | SDA | AREF | GND | 13 | 12 | ~11 | ~10 | ~9 | 8 | 7 | ~6 | ~5 | 4 | ~3 | 2 | 1 | 0 | RXI | T | R | TXO | DTR | L13 | ON | Reset | Vin | BBB | RST | 3.3V | 5V | GND | GND | Vin | A0 | A1 | A2 | A3 | A4 | A5 | BBBDuino | Vin | 3-11V